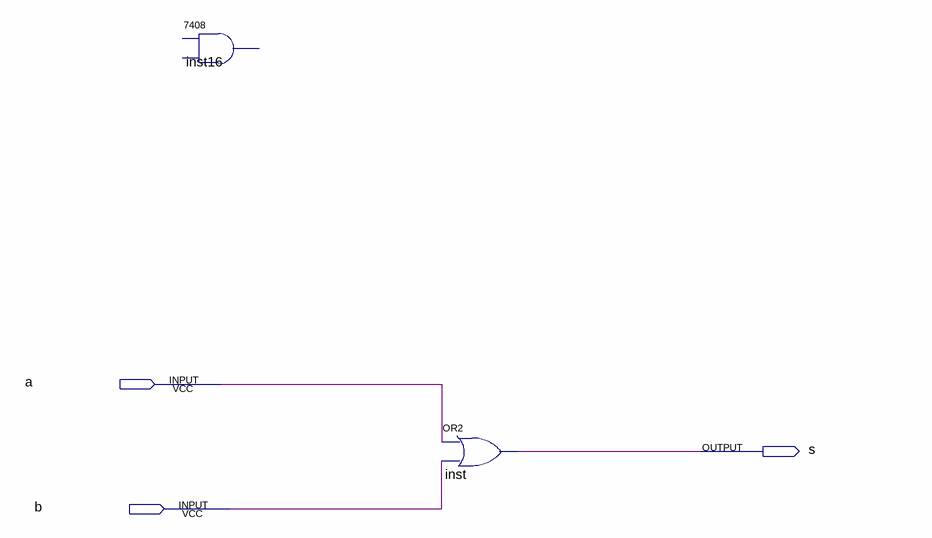
[diagram p0: schematic sheet]
// Quartus schematic orr.bdf as structural Verilog: 2 symbols, 3 pins
module orr (
  input  a,
  input  b,
  output s
);

  \7408  inst16 ();  // open: 3, 2, 1
  or inst (s, a, b);
endmodule
